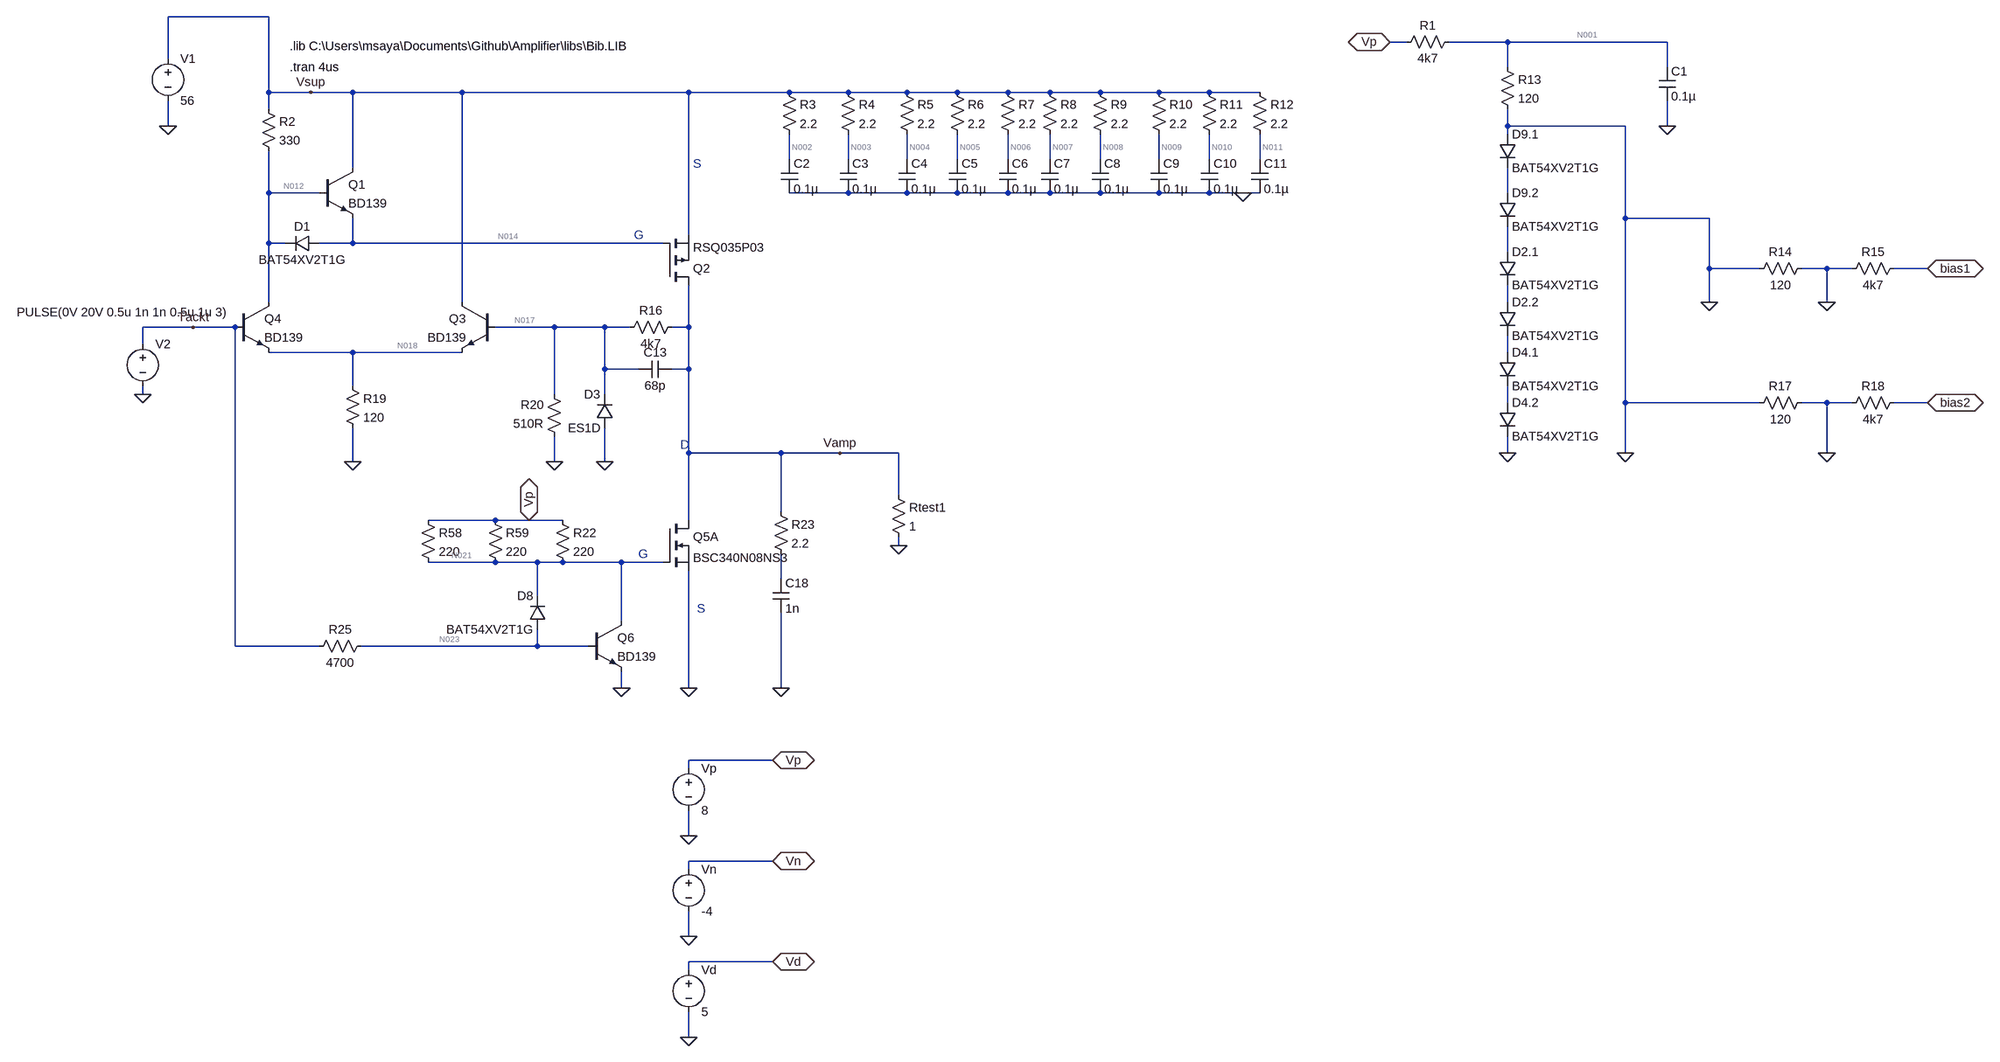
[diagram p0: schematic Switch1.asc]
Switch1.asc, the LTspice schematic file:
Version 4
SHEET 1 7116 2452
WIRE 192 -416 0 -416
WIRE 2880 -368 2848 -368
WIRE 3072 -368 2960 -368
WIRE 3376 -368 3072 -368
WIRE 0 -336 0 -416
WIRE 3072 -320 3072 -368
WIRE 3376 -320 3376 -368
WIRE 192 -272 192 -416
WIRE 272 -272 192 -272
WIRE 352 -272 272 -272
WIRE 560 -272 352 -272
WIRE 992 -272 560 -272
WIRE 1184 -272 992 -272
WIRE 1296 -272 1184 -272
WIRE 1408 -272 1296 -272
WIRE 1504 -272 1408 -272
WIRE 1600 -272 1504 -272
WIRE 1680 -272 1600 -272
WIRE 1776 -272 1680 -272
WIRE 1888 -272 1776 -272
WIRE 1984 -272 1888 -272
WIRE 2080 -272 1984 -272
WIRE 192 -240 192 -272
WIRE 0 -208 0 -256
WIRE 3072 -208 3072 -240
WIRE 3296 -208 3072 -208
WIRE 3376 -208 3376 -256
WIRE 3072 -192 3072 -208
WIRE 1184 -144 1184 -192
WIRE 1296 -144 1296 -192
WIRE 1408 -144 1408 -192
WIRE 1504 -144 1504 -192
WIRE 1600 -144 1600 -192
WIRE 1680 -144 1680 -192
WIRE 1776 -144 1776 -192
WIRE 1888 -144 1888 -192
WIRE 1984 -144 1984 -192
WIRE 2080 -144 2080 -192
WIRE 352 -128 352 -272
WIRE 192 -80 192 -160
WIRE 288 -80 192 -80
WIRE 1296 -80 1184 -80
WIRE 1408 -80 1296 -80
WIRE 1504 -80 1408 -80
WIRE 1600 -80 1504 -80
WIRE 1680 -80 1600 -80
WIRE 1776 -80 1680 -80
WIRE 1888 -80 1776 -80
WIRE 1984 -80 1888 -80
WIRE 2048 -80 1984 -80
WIRE 2080 -80 2048 -80
WIRE 3072 -80 3072 -128
WIRE 3296 -32 3296 -208
WIRE 3456 -32 3296 -32
WIRE 992 0 992 -272
WIRE 192 16 192 -80
WIRE 224 16 192 16
WIRE 352 16 352 -32
WIRE 352 16 288 16
WIRE 944 16 352 16
WIRE 3072 32 3072 -16
WIRE 3456 64 3456 -32
WIRE 3552 64 3456 64
WIRE 3680 64 3632 64
WIRE 3728 64 3680 64
WIRE 3872 64 3808 64
WIRE 192 128 192 16
WIRE 560 128 560 -272
WIRE 3072 128 3072 96
WIRE 3456 128 3456 64
WIRE 3680 128 3680 64
WIRE 48 176 -48 176
WIRE 128 176 48 176
WIRE 736 176 624 176
WIRE 832 176 736 176
WIRE 880 176 832 176
WIRE 992 176 992 96
WIRE 992 176 960 176
WIRE -48 208 -48 176
WIRE 352 224 192 224
WIRE 560 224 352 224
WIRE 3072 224 3072 192
WIRE 832 256 832 176
WIRE 896 256 832 256
WIRE 992 256 992 176
WIRE 992 256 960 256
WIRE 352 288 352 224
WIRE -48 304 -48 288
WIRE 736 304 736 176
WIRE 832 304 832 256
WIRE 3072 320 3072 288
WIRE 3296 320 3296 -32
WIRE 3552 320 3296 320
WIRE 3680 320 3632 320
WIRE 3728 320 3680 320
WIRE 3872 320 3808 320
WIRE 992 416 992 256
WIRE 1168 416 992 416
WIRE 1280 416 1168 416
WIRE 1392 416 1280 416
WIRE 3072 416 3072 384
WIRE 3296 416 3296 320
WIRE 3680 416 3680 320
WIRE 352 432 352 368
WIRE 736 432 736 384
WIRE 832 432 832 368
WIRE 1392 496 1392 416
WIRE 1168 528 1168 416
WIRE 624 544 496 544
WIRE 688 544 624 544
WIRE 752 544 688 544
WIRE 992 544 992 416
WIRE 1392 592 1392 576
WIRE 624 624 496 624
WIRE 704 624 624 624
WIRE 752 624 704 624
WIRE 864 624 752 624
WIRE 944 624 864 624
WIRE 1168 656 1168 608
WIRE 704 688 704 624
WIRE 864 736 864 624
WIRE 128 784 128 176
WIRE 288 784 128 784
WIRE 704 784 704 752
WIRE 704 784 368 784
WIRE 800 784 704 784
WIRE 864 864 864 832
WIRE 992 864 992 640
WIRE 1168 864 1168 720
WIRE 1152 1280 992 1280
WIRE 992 1296 992 1280
WIRE 992 1424 992 1376
WIRE 1152 1472 992 1472
WIRE 992 1488 992 1472
WIRE 992 1616 992 1568
WIRE 1152 1664 992 1664
WIRE 992 1680 992 1664
WIRE 992 1808 992 1760
FLAG 352 432 0
FLAG 0 -208 0
FLAG 1168 864 0
FLAG 864 864 0
FLAG 272 -272 Vsup
FLAG 1152 1280 Vp
IOPIN 1152 1280 BiDir
FLAG 992 1424 0
FLAG -48 304 0
FLAG 1280 416 Vamp
FLAG 2048 -80 0
FLAG 992 864 0
FLAG 1392 592 0
FLAG 688 544 Vp
IOPIN 688 544 BiDir
FLAG 48 176 Tackt
FLAG 2848 -368 Vp
IOPIN 2848 -368 BiDir
FLAG 3376 -208 0
FLAG 3680 128 0
FLAG 3296 416 0
FLAG 3072 416 0
FLAG 3680 416 0
FLAG 3456 128 0
FLAG 3872 64 bias1
IOPIN 3872 64 BiDir
FLAG 3872 320 bias2
IOPIN 3872 320 BiDir
FLAG 1152 1472 Vn
IOPIN 1152 1472 BiDir
FLAG 992 1616 0
FLAG 1152 1664 Vd
IOPIN 1152 1664 BiDir
FLAG 992 1808 0
FLAG 736 432 0
FLAG 832 432 0
SYMBOL voltage 0 -352 R0
WINDOW 123 0 0 Left 0
WINDOW 39 0 0 Left 0
SYMATTR InstName V1
SYMATTR Value 56
SYMBOL res 176 -256 R0
SYMATTR InstName R2
SYMATTR Value 330
SYMATTR SpiceLine pwr=0.5
SYMBOL pmos 944 96 M180
SYMATTR InstName Q2
SYMATTR Value RSQ035P03
SYMBOL nmos 944 544 R0
SYMATTR InstName Q5A
SYMATTR Value BSC340N08NS3
SYMBOL res 1168 -288 R0
SYMATTR InstName R3
SYMATTR Value 2.2
SYMBOL res 1280 -288 R0
SYMATTR InstName R4
SYMATTR Value 2.2
SYMBOL res 1392 -288 R0
SYMATTR InstName R5
SYMATTR Value 2.2
SYMBOL res 1488 -288 R0
SYMATTR InstName R6
SYMATTR Value 2.2
SYMBOL res 1584 -288 R0
SYMATTR InstName R7
SYMATTR Value 2.2
SYMBOL res 1664 -288 R0
SYMATTR InstName R8
SYMATTR Value 2.2
SYMBOL res 1760 -288 R0
SYMATTR InstName R9
SYMATTR Value 2.2
SYMBOL res 1872 -288 R0
SYMATTR InstName R10
SYMATTR Value 2.2
SYMBOL res 1968 -288 R0
SYMATTR InstName R11
SYMATTR Value 2.2
SYMBOL res 2064 -288 R0
SYMATTR InstName R12
SYMATTR Value 2.2
SYMBOL cap 1168 -144 R0
SYMATTR InstName C2
SYMATTR Value 0.1µ
SYMBOL cap 1280 -144 R0
SYMATTR InstName C3
SYMATTR Value 0.1µ
SYMBOL cap 1392 -144 R0
SYMATTR InstName C4
SYMATTR Value 0.1µ
SYMBOL cap 1488 -144 R0
SYMATTR InstName C5
SYMATTR Value 0.1µ
SYMBOL cap 1584 -144 R0
SYMATTR InstName C6
SYMATTR Value 0.1µ
SYMBOL cap 1664 -144 R0
SYMATTR InstName C7
SYMATTR Value 0.1µ
SYMBOL cap 1760 -144 R0
SYMATTR InstName C8
SYMATTR Value 0.1µ
SYMBOL cap 1872 -144 R0
SYMATTR InstName C9
SYMATTR Value 0.1µ
SYMBOL cap 1968 -144 R0
SYMATTR InstName C10
SYMATTR Value 0.1µ
SYMBOL cap 2064 -144 R0
SYMATTR InstName C11
SYMATTR Value 0.1µ
SYMBOL diode 720 752 R180
WINDOW 0 24 64 Left 2
WINDOW 3 24 0 Left 2
SYMATTR InstName D8
SYMATTR Value BAT54XV2T1G
SYMBOL res 480 528 R0
SYMATTR InstName R58
SYMATTR Value 220
SYMATTR SpiceLine pwr=0.5
SYMBOL res 608 528 R0
SYMATTR InstName R59
SYMATTR Value 220
SYMATTR SpiceLine pwr=0.5
SYMBOL res 736 528 R0
SYMATTR InstName R22
SYMATTR Value 220
SYMATTR SpiceLine pwr=0.5
SYMBOL res 384 768 R90
WINDOW 0 0 56 VBottom 2
WINDOW 3 32 56 VTop 2
SYMATTR InstName R25
SYMATTR Value 4700
SYMBOL res 336 272 R0
SYMATTR InstName R19
SYMATTR Value 120
SYMBOL res 1152 512 R0
SYMATTR InstName R23
SYMATTR Value 2.2
SYMBOL cap 1152 656 R0
SYMATTR InstName C18
SYMATTR Value 1n
SYMBOL npn 288 -128 R0
SYMATTR InstName Q1
SYMATTR Value BD139
SYMBOL npn 128 128 R0
SYMATTR InstName Q4
SYMATTR Value BD139
SYMBOL npn 800 736 R0
SYMATTR InstName Q6
SYMATTR Value BD139
SYMBOL diode 288 0 R90
WINDOW 0 0 32 VBottom 2
WINDOW 3 32 32 VTop 2
SYMATTR InstName D1
SYMATTR Value BAT54XV2T1G
SYMBOL voltage -48 192 R0
WINDOW 123 0 0 Left 0
WINDOW 39 0 0 Left 0
WINDOW 3 -240 -45 Left 2
SYMATTR Value PULSE(0V 20V 0.5u 1n 1n 0.5u 1u 3)
SYMATTR InstName V2
SYMBOL voltage 992 1280 R0
WINDOW 123 0 0 Left 0
WINDOW 39 0 0 Left 0
SYMATTR InstName Vp
SYMATTR Value 8
SYMBOL res 1376 480 R0
SYMATTR InstName Rtest1
SYMATTR Value 1
SYMBOL res 2976 -384 R90
WINDOW 0 0 56 VBottom 2
WINDOW 3 32 56 VTop 2
SYMATTR InstName R1
SYMATTR Value 4k7
SYMBOL res 3648 48 R90
WINDOW 0 0 56 VBottom 2
WINDOW 3 32 56 VTop 2
SYMATTR InstName R14
SYMATTR Value 120
SYMBOL res 3824 48 R90
WINDOW 0 0 56 VBottom 2
WINDOW 3 32 56 VTop 2
SYMATTR InstName R15
SYMATTR Value 4k7
SYMBOL res 3648 304 R90
WINDOW 0 0 56 VBottom 2
WINDOW 3 32 56 VTop 2
SYMATTR InstName R17
SYMATTR Value 120
SYMBOL res 3824 304 R90
WINDOW 0 0 56 VBottom 2
WINDOW 3 32 56 VTop 2
SYMATTR InstName R18
SYMATTR Value 4k7
SYMBOL res 3056 -336 R0
SYMATTR InstName R13
SYMATTR Value 120
SYMBOL cap 3360 -320 R0
SYMATTR InstName C1
SYMATTR Value 0.1µ
SYMBOL diode 3056 -192 R0
SYMATTR InstName D9.1
SYMATTR Value BAT54XV2T1G
SYMBOL diode 3056 -80 R0
SYMATTR InstName D9.2
SYMATTR Value BAT54XV2T1G
SYMBOL diode 3056 32 R0
SYMATTR InstName D2.1
SYMATTR Value BAT54XV2T1G
SYMBOL diode 3056 128 R0
SYMATTR InstName D2.2
SYMATTR Value BAT54XV2T1G
SYMBOL diode 3056 224 R0
SYMATTR InstName D4.1
SYMATTR Value BAT54XV2T1G
SYMBOL diode 3056 320 R0
SYMATTR InstName D4.2
SYMATTR Value BAT54XV2T1G
SYMBOL voltage 992 1472 R0
WINDOW 123 0 0 Left 0
WINDOW 39 0 0 Left 0
SYMATTR InstName Vn
SYMATTR Value -4
SYMBOL voltage 992 1664 R0
WINDOW 123 0 0 Left 0
WINDOW 39 0 0 Left 0
SYMATTR InstName Vd
SYMATTR Value 5
SYMBOL npn 624 128 M0
SYMATTR InstName Q3
SYMATTR Value BD139
SYMBOL res 976 160 R90
WINDOW 0 0 56 VBottom 2
WINDOW 3 32 56 VTop 2
SYMATTR InstName R16
SYMATTR Value 4k7
SYMBOL diode 848 368 R180
WINDOW 0 24 64 Left 2
WINDOW 3 24 0 Left 2
SYMATTR InstName D3
SYMATTR Value ES1D
SYMBOL res 752 400 R180
WINDOW 0 36 76 Left 2
WINDOW 3 36 40 Left 2
SYMATTR InstName R20
SYMATTR Value 510R
SYMBOL cap 960 240 R90
WINDOW 0 0 32 VBottom 2
WINDOW 3 32 32 VTop 2
SYMATTR InstName C13
SYMATTR Value 68p
TEXT 232 -320 Left 2 !.tran 4us
TEXT 232 -360 Left 2 !.lib C:\\Users\\msaya\\Documents\\Github\\Amplifier\\libs\\Bib.LIB
TEXT 888 0 Left 2 ;G
TEXT 896 608 Left 2 ;G
TEXT 976 400 Left 2 ;D
TEXT 1008 712 Left 2 ;S
TEXT 1000 -136 Left 2 ;S

The netlist it stands for:
* Switch1.asc
V1 Vsup 0 56
R2 Vsup N012 330 pwr=0.5
M§Q2 Vamp N014 Vsup Vsup RSQ035P03
M§Q5A Vamp N021 0 0 BSC340N08NS3
R3 Vsup N002 2.2
R4 Vsup N003 2.2
R5 Vsup N004 2.2
R6 Vsup N005 2.2
R7 Vsup N006 2.2
R8 Vsup N007 2.2
R9 Vsup N008 2.2
R10 Vsup N009 2.2
R11 Vsup N010 2.2
R12 Vsup N011 2.2
C2 N002 0 0.1µ
C3 N003 0 0.1µ
C4 N004 0 0.1µ
C5 N005 0 0.1µ
C6 N006 0 0.1µ
C7 N007 0 0.1µ
C8 N008 0 0.1µ
C9 N009 0 0.1µ
C10 N010 0 0.1µ
C11 N011 0 0.1µ
D8 N023 N021 BAT54XV2T1G
R58 Vp N021 220 pwr=0.5
R59 Vp N021 220 pwr=0.5
R22 Vp N021 220 pwr=0.5
R25 N023 Tackt 4700
R19 N018 0 120
R23 Vamp N022 2.2
C18 N022 0 1n
Q1 Vsup N012 N014 0 BD139
Q4 N012 Tackt N018 0 BD139
Q6 N021 N023 0 0 BD139
D1 N014 N012 BAT54XV2T1G
V2 Tackt 0 PULSE(0V 20V 0.5u 1n 1n 0.5u 1u 3)
Vp Vp 0 8
Rtest1 Vamp 0 1
R1 N001 Vp 4k7
R14 0 0 120
R15 bias1 0 4k7
R17 0 0 120
R18 bias2 0 4k7
R13 N001 0 120
C1 N001 0 0.1µ
D9.1 0 N013 BAT54XV2T1G
D9.2 N013 N015 BAT54XV2T1G
D2.1 N015 N016 BAT54XV2T1G
D2.2 N016 N019 BAT54XV2T1G
D4.1 N019 N020 BAT54XV2T1G
D4.2 N020 0 BAT54XV2T1G
Vn Vn 0 -4
Vd Vd 0 5
Q3 Vsup N017 N018 0 BD139
R16 Vamp N017 4k7
D3 0 N017 ES1D
R20 0 N017 510R
C13 Vamp N017 68p
.model D D
.lib standard.dio
.model NPN NPN
.model PNP PNP
.lib standard.bjt
.model NMOS NMOS
.model PMOS PMOS
.lib standard.mos
.tran 4us
.lib C:\Users\msaya\Documents\Github\Amplifier\libs\Bib.LIB
* G
* G
* D
* S
* S
.backanno
.end

* Results of the author's LTspice run, read from the files saved beside the schematic
* Operating Point, zero values left out:
*   V(vsup) = 56 V
*   V(n012) = 56 V
*   V(n014) = 56 V
*   V(n021) = 8 V
*   V(n002) = 56 V
*   V(n003) = 56 V
*   V(n004) = 56 V
*   V(n005) = 56 V
*   V(n006) = 56 V
*   V(n007) = 56 V
*   V(n008) = 56 V
*   V(n009) = 56 V
*   V(n010) = 56 V
*   V(n011) = 56 V
*   V(n023) = 117.2 µV
*   V(vp) = 8 V
*   V(n018) = 609.2 nV
*   V(n001) = 199.2 mV
*   V(vn) = -4 V
*   V(vd) = 5 V
*   V(n017) = 2.666 µV
*   Ie(Q1) = 15.04 pA
*   Ic(Q4) = 8.358 nA
*   Ib(Q4) = -5.82 nA
*   Ie(Q4) = -2.538 nA
*   Ic(Q6) = 6.998 nA
*   Ib(Q6) = -5.756 nA
*   Ie(Q6) = -1.242 nA
*   Ic(Q3) = 8.358 nA
*   Ib(Q3) = -5.819 nA
*   Ie(Q3) = -2.539 nA
*   Id(Q2) = -719.2 pA
*   Is(Q2) = 719.2 pA
*   Id(Q5a) = 1.303 nA
*   Is(Q5a) = -1.303 nA
*   I(D8) = -19.19 nA
*   I(D1) = 2.677 pA
*   I(D3) = -25.76 pA
*   I(R2) = 8.354 nA
*   I(R58) = 8.73 nA
*   I(R59) = 8.73 nA
*   I(R22) = 8.73 nA
*   I(R25) = 24.95 nA
*   I(R19) = 5.077 nA
*   I(Rtest1) = 39.27 pA
*   I(R1) = -1.66 mA
*   I(R13) = 1.66 mA
*   I(R16) = -567.1 pA
*   I(R20) = -5.227 nA
*   I(V1) = -17.49 nA
*   I(V2) = 30.77 nA
*   I(Vp) = -1.66 mA
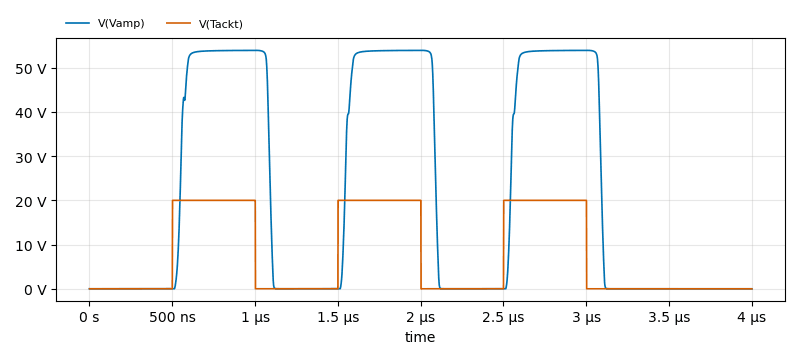
[diagram p1: Transient Analysis of Switch1.asc, plotted from the saved traces]
* Transient Analysis, 1 run:
*   V(Vamp): min -781.4 µV, max 53.91 V, average 21.65 V, rms 33.54 V, last 0 V
*   V(Tackt): min 0 V, max 20 V, average 7.515 V, rms 12.26 V, last 0 V